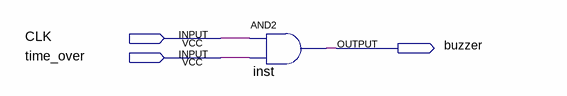
[diagram p0: schematic sheet]
// Quartus schematic buzzer.bdf as structural Verilog: 1 symbols, 3 pins
module buzzer (
  input  CLK,
  input  time_over,
  output buzzer
);

  and inst (buzzer, CLK, time_over);
endmodule
